# Altium schematic sheet Optical_TX.SchDoc
size A4; Author: T. Kreppel; CompanyName: Technische Universität München; Organization: TUM EAL; Address1: Arcisstraße 21; Address2: 80333 München; Address3: GERMANY; SheetNumber: 4; SheetTotal: 6; CompanyName2: Lehrstuhl für Elektrische Antriebsrechnik u. Leistungselektronik
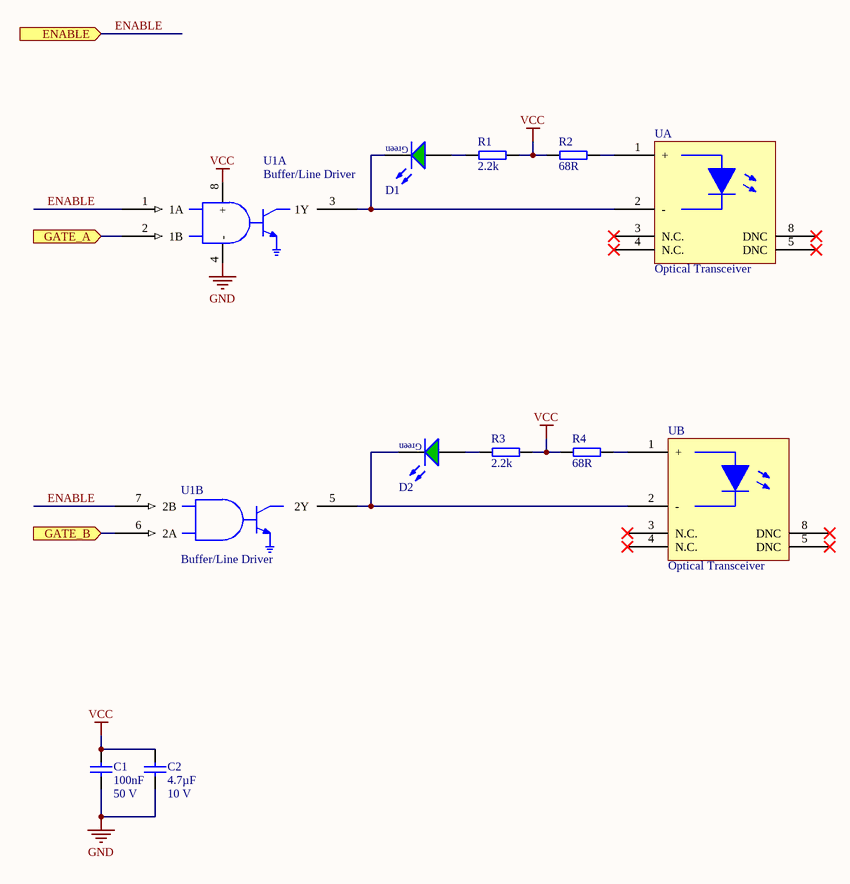
[diagram p0: Optical_TX.SchDoc]

## Parts
C1  Voltage: 50 V  [C_0603(1608)100_L]  (hidden comment: 100nF)
C2  Voltage: 10 V  [C_0603(1608)100_L]  (hidden comment: 4.7µF)
D1  150060GS75000  [WL-SMCW_0603]  (value not drawn)
D2  150060GS75000  [WL-SMCW_0603]  (value not drawn)
R1  2.2k  [R_0603_N]
R2  68R  [R_0603_N]
R3  2.2k  [R_0603_N]
R4  68R  [R_0603_N]
U1  Buffer/Line Driver  [SOIC127P600X175-8N]  (parts A,B of 2)
UA  Optical Transceiver  [HFBRx5XX]
UB  Optical Transceiver  [HFBRx5XX]

## Ports
ENABLE (in), GATE_A (in), GATE_B (in)

## Nets
GND: C1.2 C2.2 U1.4(-)
VCC: C1.1 C2.1 R1.1 R2.2 R3.1 R4.2 U1.8(+)
ENABLE: U1.1(1A) U1.7(2B) ; port ENABLE
GATE_A: U1.2(1B) ; port GATE_A
GATE_B: U1.6(2A) ; port GATE_B
NetD1_1: D1.1(K) U1.3(1Y) UA.2(-)
NetD1_2: D1.2(A) R1.2
NetD2_1: D2.1(K) U1.5(2Y) UB.2(-)
NetD2_2: D2.2(A) R3.2
NetR2_1: R2.1 UA.1(+)
NetR4_1: R4.1 UB.1(+)

Not connected (* = marked no-connect by the designer): UA 3(N.C.)* 4(N.C.)* 5(DNC)* 8(DNC)*; UB 3(N.C.)* 4(N.C.)* 5(DNC)* 8(DNC)*

## Notes on the sheet
- Title
- Size:
- Date:
- A4
- Revision:
- Time:
- Sheet
- of
- Author:
- Project:

## Library data of the parts
C1 = C_0603: CAP 0603 (1608 Metric) SMD; MPN: CC0603MRY5V9BB104; Tolerance: ±20%; Case-Metric: 1608; Dielectric: X5V; MF: Yageo; Case-EIA: 0603; Max Thickness: 1 mm; Technology: SMT; Created: 2018_09_06_AGeiger; Supplier 1: Mouser; Supplier Part Number 1: 603-C0603MRY5V9BB104; Value: 100nF; Package: 0603
C2 = C_0603: CAP 0603 (1608 Metric) SMD; MPN: LMK107BJ475KA-T; Tolerance: ±10%; Case-Metric: 1608; Dielectric: X5R; MF: Taio Yuden; Case-EIA: 0603; Max Thickness: 1 mm; Technology: SMT; Created: 2018_09_06_AGeiger; Supplier 1: Mouser; Supplier Part Number 1: 963-LMK107BJ475KA-T; Value: 4.7µF; Package: 0603
D1 D2 = LED_Green_0603: WL-SMCW SMD Mono-color Chip LED Waterclear, size 0603, Green, 3.2 V, 140°; Forward Voltage: 3.2 V; Luminous Intensity: 430 mcd; Peak Wavelength: 515 nm; Dominant Wavelength: 520 nm; MF: Wuerth Elektronik; Published Date: Sep. 2017; ComponentLink1Description: Manufacturer; ComponentLink1URL: http://www.we-online.de; ComponentLink2Description: Datasheet; ComponentLink2URL: http://katalog.we-online.com/led/datasheet/150060GS75000.pdf; MPN: 150060GS75000; Size: 0603; Viewing Angle: 140°; Emitting Color: Green; Value: 150060GS75000; Package: 0603; Created: 2018_09_06_AGeiger; Supplier 1: Farnell; Supplier Part Number 1: 2322070; Supplier 2: Mouser; Supplier Part Number 2: 710-150060GS75000; Supplier 3: Digi-Key; Supplier Part Number 3: 732-4971-1-ND
R1 R3 = R_0603: SMD Resistor 0603; MPN: CRCW06032K20FKEAC; Tolerance: 1%; Voltage: 75V; Power: 100 mW; MF: Vishay; Package: 0603; Value: 2.2k; Created: 2018_09_06_AGeiger; Supplier 1: Mouser; Supplier Part Number 1: 71-CRCW06032K20FKEAC
R2 R4 = R_0603: SMD Resistor 0603; MPN: RCS060368R0FKEA; Tolerance: 1%; Voltage: 75V; Power: 250 mW; MF: Vishay; Package: 0603; Value: 68R; Created: 2018_09_06_AGeiger; Supplier 1: Mouser; Supplier Part Number 1: 71-RCS060368R0FKEA
U1 = SN75452BDR: Buffers & Line Drivers Dual Very-HS HC Peripheral Drivers; MF: Texas Instruments; Supply Voltage: 4.75-5.25 V; Created: 2019_04_09_Kreppel; MPN: SN75452BDR; Package: SOIC-8; Supplier 1: Mouser; Supplier Part Number 1: 595-SN75452BDR
UA UB = HFBR-1521Z: Fibre Optic Transmitters, Receivers, Transceivers Versatile Link Horiz 5MBd Tx RoHS; MF: Broadcom/Avago; Wavelength: 660 nm; Foreward Current: 60 mA; Supply Voltage: 5V; Created: 2019_04_09_Kreppel; MPN: HFBR-1521Z; Data Rate: 5 MBd; Supplier 1: Mouser; Supplier 2: Digi-Key; Supplier Part Number 1: 630-HFBR-1521Z; Supplier Part Number 2: 516-2043-ND